# Altium schematic sheet 5_Motors_MCU.SchDoc
size A3; SheetNumber: 4; SheetTotal: 5
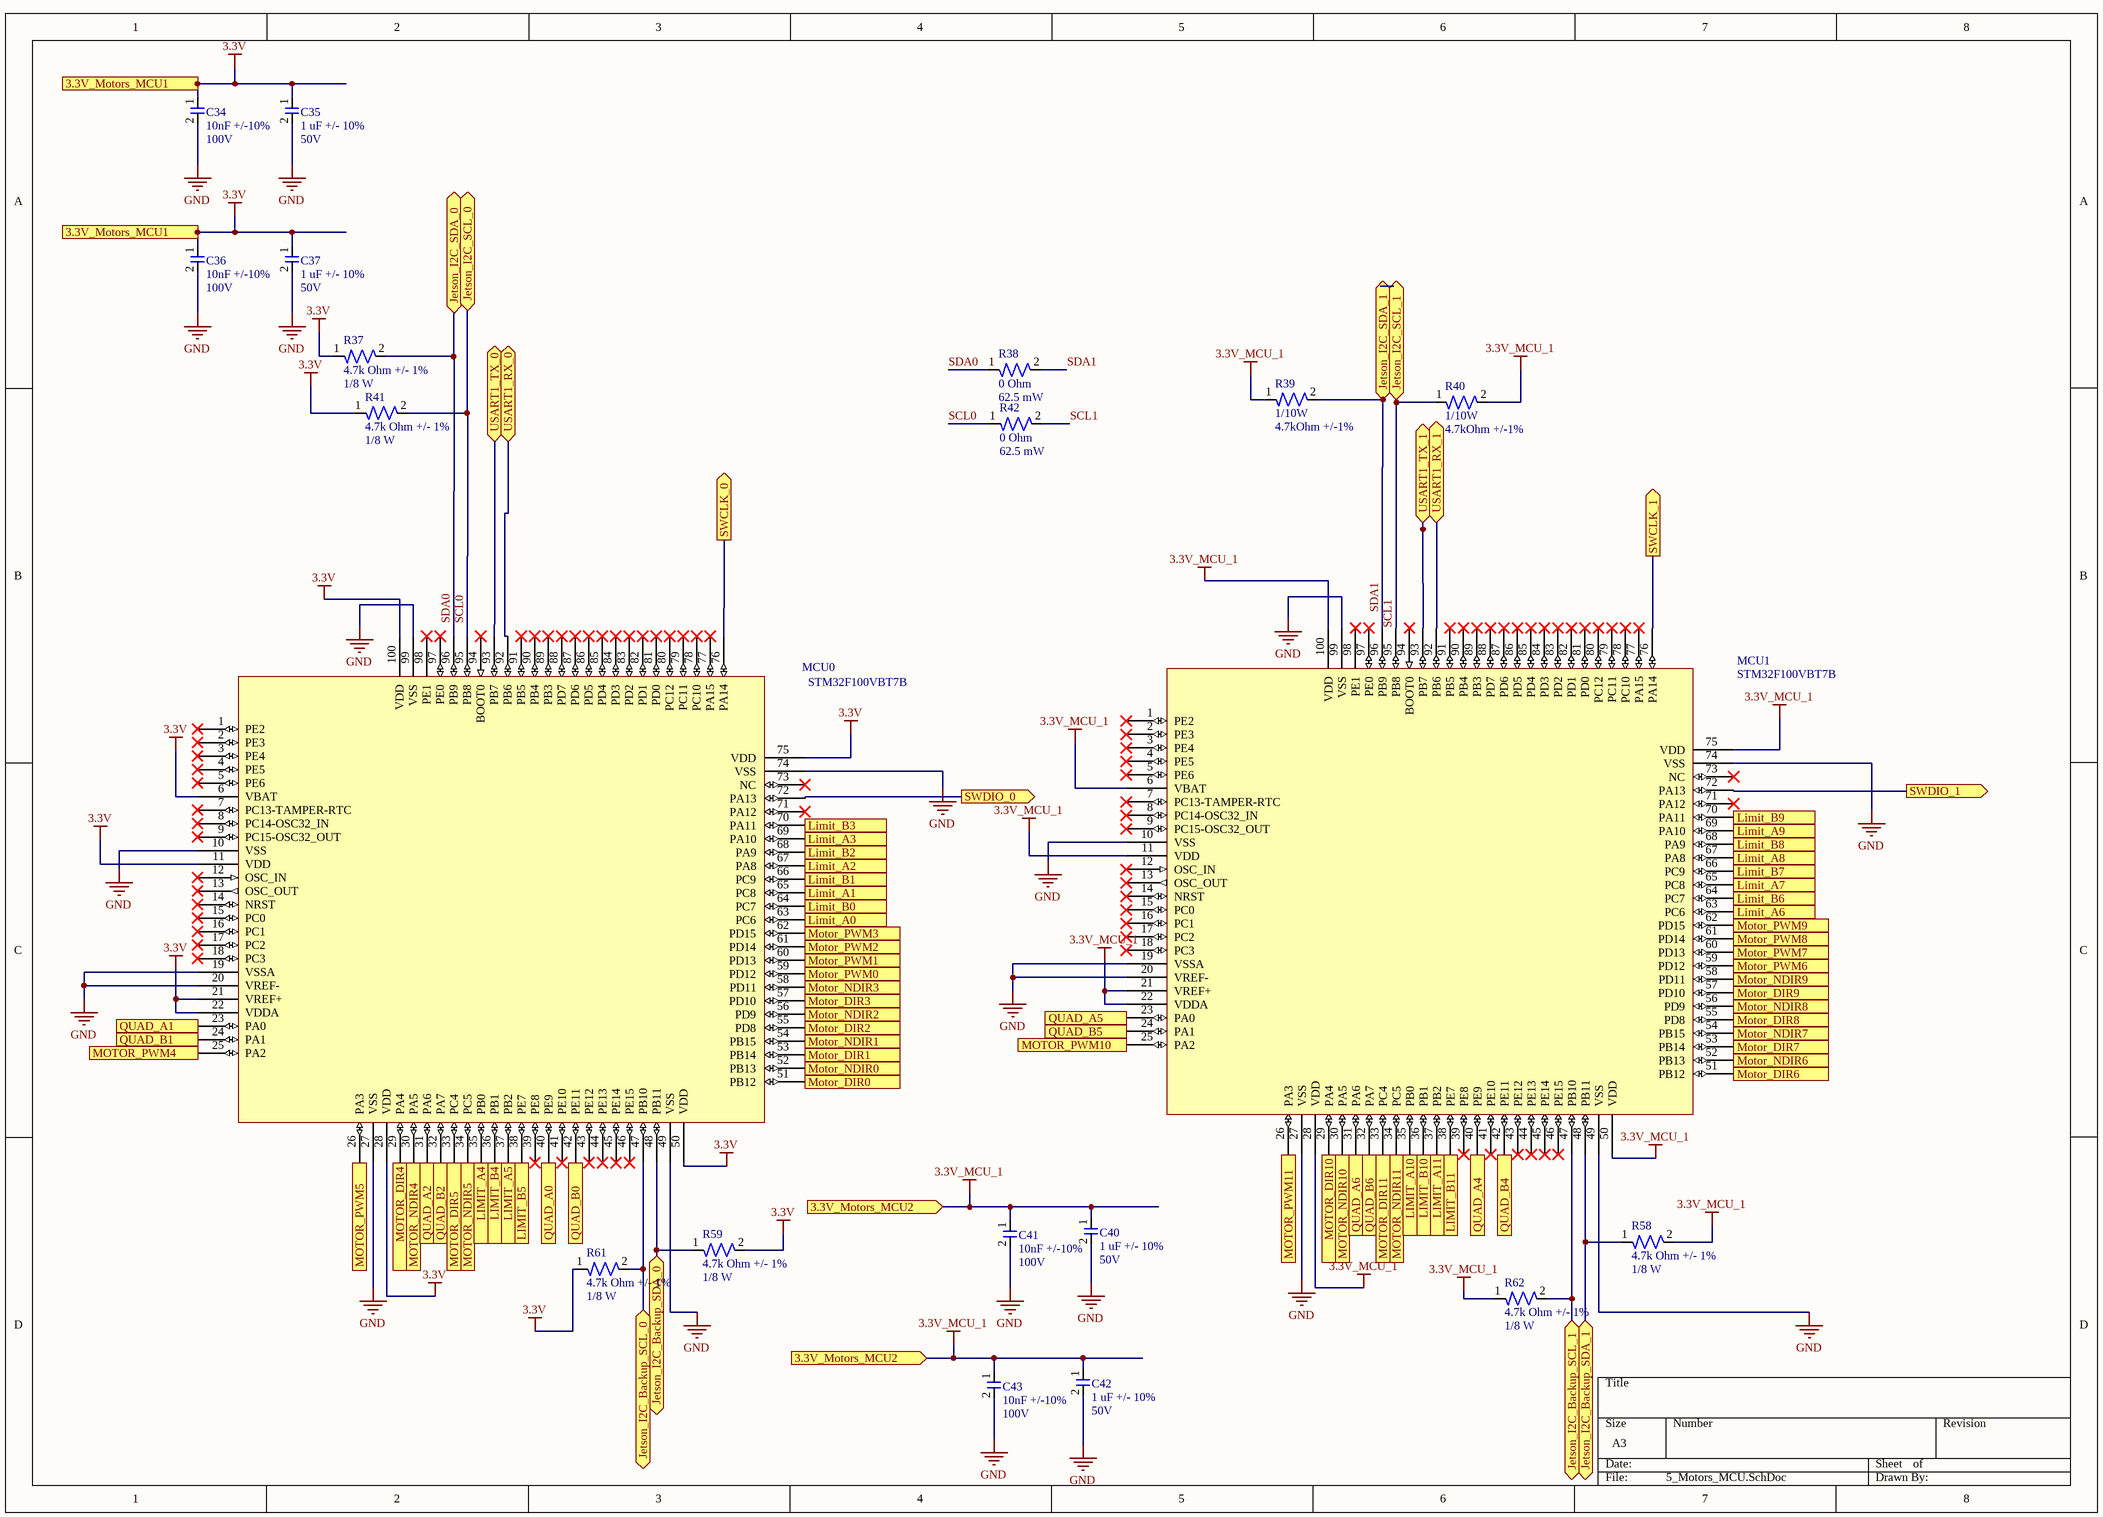
[diagram p0: 5_Motors_MCU.SchDoc]

## Parts
C34  Capacitance: 10nF +/-10%  Voltage Rating: 100V  [CAP-0603]  (hidden comment: CC0603KRX7R0BB103)
C35  Cap: 1 uF +/- 10%  Voltage: 50V  [CAP-0805]  (hidden comment: GCM21BR71H105KA03L)
C36  Capacitance: 10nF +/-10%  Voltage Rating: 100V  [CAP-0603]  (hidden comment: CC0603KRX7R0BB103)
C37  Cap: 1 uF +/- 10%  Voltage: 50V  [CAP-0805]  (hidden comment: GCM21BR71H105KA03L)
C40  Cap: 1 uF +/- 10%  Voltage: 50V  [CAP-0805]  (hidden comment: GCM21BR71H105KA03L)
C41  Capacitance: 10nF +/-10%  Voltage Rating: 100V  [CAP-0603]  (hidden comment: CC0603KRX7R0BB103)
C42  Cap: 1 uF +/- 10%  Voltage: 50V  [CAP-0805]  (hidden comment: GCM21BR71H105KA03L)
C43  Capacitance: 10nF +/-10%  Voltage Rating: 100V  [CAP-0603]  (hidden comment: CC0603KRX7R0BB103)
MCU0  STM32F100VBT7B  [IC-STM32F100-0001]
MCU1  STM32F100VBT7B  [IC-STM32F100-0001]
R37  Resistance: 4.7k Ohm +/- 1%  Power: 1/8 W  [RES-0402]  (hidden comment: RC0402FR-7W4K7L)
R38  Resistance: 0 Ohm  Power: 62.5 mW  [RES-0402]  (hidden comment: RC0402FR-070RL)
R39  Power Rating: 1/10W  Resistance: 4.7kOhm +/-1%  [RES-0603]  (hidden comment: AF0603FR-074K7L)
R40  Power Rating: 1/10W  Resistance: 4.7kOhm +/-1%  [RES-0603]  (hidden comment: AF0603FR-074K7L)
R41  Resistance: 4.7k Ohm +/- 1%  Power: 1/8 W  [RES-0402]  (hidden comment: RC0402FR-7W4K7L)
R42  Resistance: 0 Ohm  Power: 62.5 mW  [RES-0402]  (hidden comment: RC0402FR-070RL)
R58  Resistance: 4.7k Ohm +/- 1%  Power: 1/8 W  [RES-0402]  (hidden comment: RC0402FR-7W4K7L)
R59  Resistance: 4.7k Ohm +/- 1%  Power: 1/8 W  [RES-0402]  (hidden comment: RC0402FR-7W4K7L)
R61  Resistance: 4.7k Ohm +/- 1%  Power: 1/8 W  [RES-0402]  (hidden comment: RC0402FR-7W4K7L)
R62  Resistance: 4.7k Ohm +/- 1%  Power: 1/8 W  [RES-0402]  (hidden comment: RC0402FR-7W4K7L)

## Ports
3.3V_Motors_MCU1 (in), 3.3V_Motors_MCU2 (in), Jetson_I2C_Backup_SCL_0 (bidir), Jetson_I2C_Backup_SCL_1 (bidir), Jetson_I2C_Backup_SDA_0 (bidir), Jetson_I2C_Backup_SDA_1 (bidir), Jetson_I2C_SCL_0 (bidir), Jetson_I2C_SCL_1 (bidir), Jetson_I2C_SDA_0 (bidir), Jetson_I2C_SDA_1 (bidir), Limit_A0 (out), Limit_A1 (out), Limit_A2 (out), Limit_A3 (out), LIMIT_A4 (out), LIMIT_A5 (out), Limit_A6 (out), Limit_A7 (out), Limit_A8 (out), Limit_A9 (out), LIMIT_A10 (out), LIMIT_A11 (out), Limit_B0 (out), Limit_B1 (out), Limit_B2 (out), Limit_B3 (out), LIMIT_B4 (out), LIMIT_B5 (out), Limit_B6 (out), Limit_B7 (out), Limit_B8 (out), Limit_B9 (out), LIMIT_B10 (out), LIMIT_B11 (out), Motor_DIR0 (out), Motor_DIR1 (out), Motor_DIR2 (out), Motor_DIR3 (out), MOTOR_DIR4 (out), MOTOR_DIR5 (out), Motor_DIR6 (out), Motor_DIR7 (out), Motor_DIR8 (out), Motor_DIR9 (out), MOTOR_DIR10 (out), MOTOR_DIR11 (out), Motor_NDIR0 (out), Motor_NDIR1 (out), Motor_NDIR2 (out), Motor_NDIR3 (out), MOTOR_NDIR4 (out), MOTOR_NDIR5 (out), Motor_NDIR6 (out), Motor_NDIR7 (out), Motor_NDIR8 (out), Motor_NDIR9 (out), MOTOR_NDIR10 (out), MOTOR_NDIR11 (out), Motor_PWM0 (out), Motor_PWM1 (out), Motor_PWM2 (out), Motor_PWM3 (out), MOTOR_PWM4 (out), MOTOR_PWM5 (out), Motor_PWM6 (out), Motor_PWM7 (out), Motor_PWM8 (out), Motor_PWM9 (out), MOTOR_PWM10 (out), MOTOR_PWM11 (out), QUAD_A0 (out), QUAD_A1 (out), QUAD_A2 (out), QUAD_A4 (out), QUAD_A5 (out), QUAD_A6 (out), QUAD_B0 (out), QUAD_B1 (out), QUAD_B2 (out), QUAD_B4 (out), QUAD_B5 (out), QUAD_B6 (out), SWCLK_0 (out), SWCLK_1 (out), SWDIO_0 (out), SWDIO_1 (out), USART1_RX_0 (bidir), USART1_RX_1 (bidir), USART1_TX_0 (bidir), USART1_TX_1 (bidir)

## Nets
3.3V: C34.1 C35.1 C36.1 C37.1 MCU0.6(VBAT) MCU0.11(VDD) MCU0.21(VREF+) MCU0.22(VDDA) MCU0.28(VDD) MCU0.50(VDD) MCU0.75(VDD) MCU0.100(VDD) R37.1 R41.1 R59.2 R61.1 ; port 3.3V_Motors_MCU1
3.3V_MCU_1: C40.1 C41.1 C42.1 C43.1 MCU1.6(VBAT) MCU1.11(VDD) MCU1.21(VREF+) MCU1.22(VDDA) MCU1.28(VDD) MCU1.50(VDD) MCU1.75(VDD) MCU1.100(VDD) R39.1 R40.2 R58.2 R62.1 ; port 3.3V_Motors_MCU2
GND: C34.2 C35.2 C36.2 C37.2 C40.2 C41.2 C42.2 C43.2 MCU0.10(VSS) MCU0.19(VSSA) MCU0.20(VREF-) MCU0.27(VSS) MCU0.49(VSS) MCU0.74(VSS) MCU0.99(VSS) MCU1.10(VSS) MCU1.19(VSSA) MCU1.20(VREF-) MCU1.27(VSS) MCU1.49(VSS) MCU1.74(VSS) MCU1.99(VSS)
Jetson_I2C_Backup_SCL_0: MCU0.47(PB10) R61.2 ; port Jetson_I2C_Backup_SCL_0
Jetson_I2C_Backup_SCL_1: MCU1.47(PB10) R62.2 ; port Jetson_I2C_Backup_SCL_1
Jetson_I2C_Backup_SDA_0: MCU0.48(PB11) R59.1 ; port Jetson_I2C_Backup_SDA_0
Jetson_I2C_Backup_SDA_1: MCU1.48(PB11) R58.1 ; port Jetson_I2C_Backup_SDA_1
Limit_A0: MCU0.63(PC6) ; port Limit_A0
Limit_A1: MCU0.65(PC8) ; port Limit_A1
Limit_A2: MCU0.67(PA8) ; port Limit_A2
Limit_A3: MCU0.69(PA10) ; port Limit_A3
LIMIT_A4: MCU0.35(PB0) ; port LIMIT_A4
LIMIT_A5: MCU0.37(PB2) ; port LIMIT_A5
Limit_A6: MCU1.63(PC6) ; port Limit_A6
Limit_A7: MCU1.65(PC8) ; port Limit_A7
Limit_A8: MCU1.67(PA8) ; port Limit_A8
Limit_A9: MCU1.69(PA10) ; port Limit_A9
LIMIT_A10: MCU1.35(PB0) ; port LIMIT_A10
LIMIT_A11: MCU1.37(PB2) ; port LIMIT_A11
Limit_B0: MCU0.64(PC7) ; port Limit_B0
Limit_B1: MCU0.66(PC9) ; port Limit_B1
Limit_B2: MCU0.68(PA9) ; port Limit_B2
Limit_B3: MCU0.70(PA11) ; port Limit_B3
LIMIT_B4: MCU0.36(PB1) ; port LIMIT_B4
LIMIT_B5: MCU0.38(PE7) ; port LIMIT_B5
Limit_B6: MCU1.64(PC7) ; port Limit_B6
Limit_B7: MCU1.66(PC9) ; port Limit_B7
Limit_B8: MCU1.68(PA9) ; port Limit_B8
Limit_B9: MCU1.70(PA11) ; port Limit_B9
LIMIT_B10: MCU1.36(PB1) ; port LIMIT_B10
LIMIT_B11: MCU1.38(PE7) ; port LIMIT_B11
Motor_DIR0: MCU0.51(PB12) ; port Motor_DIR0
Motor_DIR1: MCU0.53(PB14) ; port Motor_DIR1
Motor_DIR2: MCU0.55(PD8) ; port Motor_DIR2
Motor_DIR3: MCU0.57(PD10) ; port Motor_DIR3
MOTOR_DIR4: MCU0.29(PA4) ; port MOTOR_DIR4
MOTOR_DIR5: MCU0.33(PC4) ; port MOTOR_DIR5
Motor_DIR6: MCU1.51(PB12) ; port Motor_DIR6
Motor_DIR7: MCU1.53(PB14) ; port Motor_DIR7
Motor_DIR8: MCU1.55(PD8) ; port Motor_DIR8
Motor_DIR9: MCU1.57(PD10) ; port Motor_DIR9
MOTOR_DIR10: MCU1.29(PA4) ; port MOTOR_DIR10
MOTOR_DIR11: MCU1.33(PC4) ; port MOTOR_DIR11
Motor_NDIR0: MCU0.52(PB13) ; port Motor_NDIR0
Motor_NDIR1: MCU0.54(PB15) ; port Motor_NDIR1
Motor_NDIR2: MCU0.56(PD9) ; port Motor_NDIR2
Motor_NDIR3: MCU0.58(PD11) ; port Motor_NDIR3
MOTOR_NDIR4: MCU0.30(PA5) ; port MOTOR_NDIR4
MOTOR_NDIR5: MCU0.34(PC5) ; port MOTOR_NDIR5
Motor_NDIR6: MCU1.52(PB13) ; port Motor_NDIR6
Motor_NDIR7: MCU1.54(PB15) ; port Motor_NDIR7
Motor_NDIR8: MCU1.56(PD9) ; port Motor_NDIR8
Motor_NDIR9: MCU1.58(PD11) ; port Motor_NDIR9
MOTOR_NDIR10: MCU1.30(PA5) ; port MOTOR_NDIR10
MOTOR_NDIR11: MCU1.34(PC5) ; port MOTOR_NDIR11
Motor_PWM0: MCU0.59(PD12) ; port Motor_PWM0
Motor_PWM1: MCU0.60(PD13) ; port Motor_PWM1
Motor_PWM2: MCU0.61(PD14) ; port Motor_PWM2
Motor_PWM3: MCU0.62(PD15) ; port Motor_PWM3
MOTOR_PWM4: MCU0.25(PA2) ; port MOTOR_PWM4
MOTOR_PWM5: MCU0.26(PA3) ; port MOTOR_PWM5
Motor_PWM6: MCU1.59(PD12) ; port Motor_PWM6
Motor_PWM7: MCU1.60(PD13) ; port Motor_PWM7
Motor_PWM8: MCU1.61(PD14) ; port Motor_PWM8
Motor_PWM9: MCU1.62(PD15) ; port Motor_PWM9
MOTOR_PWM10: MCU1.25(PA2) ; port MOTOR_PWM10
MOTOR_PWM11: MCU1.26(PA3) ; port MOTOR_PWM11
QUAD_A0: MCU0.40(PE9) ; port QUAD_A0
QUAD_A1: MCU0.23(PA0) ; port QUAD_A1
QUAD_A2: MCU0.31(PA6) ; port QUAD_A2
QUAD_A4: MCU1.40(PE9) ; port QUAD_A4
QUAD_A5: MCU1.23(PA0) ; port QUAD_A5
QUAD_A6: MCU1.31(PA6) ; port QUAD_A6
QUAD_B0: MCU0.42(PE11) ; port QUAD_B0
QUAD_B1: MCU0.24(PA1) ; port QUAD_B1
QUAD_B2: MCU0.32(PA7) ; port QUAD_B2
QUAD_B4: MCU1.42(PE11) ; port QUAD_B4
QUAD_B5: MCU1.24(PA1) ; port QUAD_B5
QUAD_B6: MCU1.32(PA7) ; port QUAD_B6
SCL0: MCU0.95(PB8) R41.2 R42.1 ; port Jetson_I2C_SCL_0
SCL1: MCU1.95(PB8) R40.1 R42.2 ; port Jetson_I2C_SCL_1
SDA0: MCU0.96(PB9) R37.2 R38.1 ; port Jetson_I2C_SDA_0
SDA1: MCU1.96(PB9) R38.2 R39.2 ; port Jetson_I2C_SDA_1
SWCLK_0: MCU0.76(PA14) ; port SWCLK_0
SWCLK_1: MCU1.76(PA14) ; port SWCLK_1
SWDIO_0: MCU0.72(PA13) ; port SWDIO_0
SWDIO_1: MCU1.72(PA13) ; port SWDIO_1
USART1_RX_0: MCU0.92(PB6) ; port USART1_RX_0
USART1_RX_1: MCU1.92(PB6) ; port USART1_RX_1
USART1_TX_0: MCU0.93(PB7) ; port USART1_TX_0
USART1_TX_1: MCU1.93(PB7) ; port USART1_TX_1

Not connected (* = marked no-connect by the designer): MCU0 1(PE2)* 2(PE3)* 3(PE4)* 4(PE5)* 5(PE6)* 7(PC13-TAMPER-RTC)* 8(PC14-OSC32_IN)* 9(PC15-OSC32_OUT)* 12(OSC_IN)* 13(OSC_OUT)* 14(NRST)* 15(PC0)* 16(PC1)* 17(PC2)* 18(PC3)* 39(PE8)* 41(PE10)* 43(PE12)* 44(PE13)* 45(PE14)* 46(PE15)* 71(PA12)* 73(NC)* 77(PA15)* 78(PC10)* 79(PC11)* 80(PC12)* 81(PD0)* 82(PD1)* 83(PD2)* 84(PD3)* 85(PD4)* 86(PD5)* 87(PD6)* 88(PD7)* 89(PB3)* 90(PB4)* 91(PB5)* 94(BOOT0)* 97(PE0)* 98(PE1)*; MCU1 1(PE2)* 2(PE3)* 3(PE4)* 4(PE5)* 5(PE6)* 7(PC13-TAMPER-RTC)* 8(PC14-OSC32_IN)* 9(PC15-OSC32_OUT)* 12(OSC_IN)* 13(OSC_OUT)* 14(NRST)* 15(PC0)* 16(PC1)* 17(PC2)* 18(PC3)* 39(PE8)* 41(PE10)* 43(PE12)* 44(PE13)* 45(PE14)* 46(PE15)* 71(PA12)* 73(NC)* 77(PA15)* 78(PC10)* 79(PC11)* 80(PC12)* 81(PD0)* 82(PD1)* 83(PD2)* 84(PD3)* 85(PD4)* 86(PD5)* 87(PD6)* 88(PD7)* 89(PB3)* 90(PB4)* 91(PB5)* 94(BOOT0)* 97(PE0)* 98(PE1)*

## Library data of the parts
C34 C36 C41 C43 = CAP-10N-0003-JLC: 100V 10nF X7R ±10% 0603 Multilayer Ceramic Capacitors MLCC - SMD/SMT ROHS; Manufacturer: Yageo; Assembled?: yes; Manufacturer Part Number: CC0603KRX7R0BB103; Temperature Coefficient: X7R; Package Size: 0603; JLC Part Number: C107059
C35 C37 C40 C42 = CAP-1U-0003-JLC: 50V 1uF X7R ±10% 0805 Multilayer Ceramic Capacitors MLCC - SMD/SMT ROHS; assembled?: yes; JLC Part Number: C126592
MCU0 MCU1 = IC-STM32F100-0001: ARM® Cortex®-M3 STM32F1 Microcontroller IC 32-Bit Single-Core 24MHz 128KB (128K x 8) FLASH 100-LQFP (14x14); VCC: 2 ~ 3.6V; Manufacturer Part Number: STM32F100VBT7B; Package Size: 100-LQFP
R37 R41 R58 R59 R61 R62 = RES-4.7K-0003-JLC: 125mW Thick Film Resistors 50V ±1% ±200ppm/℃ -55℃~+155℃ 4.7kΩ 0402  Chip Resistor - Surface Mount ROHS; assembled?: yes; JLC part number: C606173
R38 R42 = RES-0-0002-JLC: 62.5mW Thick Film Resistors 50V -55℃~+155℃ 0Ω 0402 Chip Resistor - Surface Mount ROHS; assembled?: yes; JLC part number: C106231
R39 R40 = RES-4.7K-0002: RES SMD 4.7K OHM 1% 1/10W 0603; Manufacturer: YAGEO; Assembled?: no; Manufacturer Part Number: AF0603FR-074K7L; Package Size: 0603